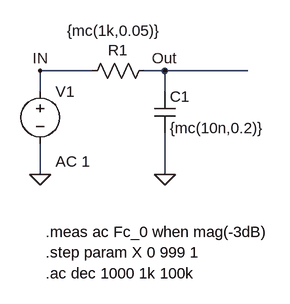
[diagram p0: schematic 蒙特卡洛分析_器件容差随机分布 对RC低通滤波器截至性能的影响.asc]
蒙特卡洛分析_器件容差随机分布 对RC低通滤波器截至性能的影响.asc, the LTspice schematic file:
Version 4.1
SHEET 1 880 680
WIRE 192 80 112 80
WIRE 304 80 272 80
WIRE 432 80 304 80
WIRE 112 112 112 80
WIRE 304 112 304 80
WIRE 112 240 112 192
WIRE 304 240 304 176
FLAG 112 240 0
FLAG 304 240 0
FLAG 304 80 Out
FLAG 112 80 IN
SYMBOL voltage 112 96 R0
WINDOW 123 24 124 Left 2
WINDOW 39 0 0 Left 0
SYMATTR InstName V1
SYMATTR Value ""
SYMATTR Value2 AC 1
SYMBOL cap 288 112 R0
SYMATTR InstName C1
SYMATTR Value {mc(10n,0.2)}
SYMBOL res 288 64 R90
WINDOW 0 0 56 VBottom 2
WINDOW 3 -61 62 VTop 2
SYMATTR InstName R1
SYMATTR Value {mc(1k,0.05)}
TEXT 120 328 Left 2 !.meas ac Fc_0 when mag(-3dB)
TEXT 120 360 Left 2 !.step param X 0 999 1
TEXT 120 392 Left 2 !.ac dec 1000 1k 100k

The netlist it stands for:
* 蒙特卡洛分析_器件容差随机分布 对RC低通滤波器截至性能的影响.asc
V1 IN 0 AC 1
C1 Out 0 {mc(10n,0.2)}
R1 Out IN {mc(1k,0.05)}
.meas ac Fc_0 when mag(-3dB)
.step param X 0 999 1
.ac dec 1000 1k 100k
.backanno
.end